# EAGLE design darwin-radio (EAGLE 9.4.2)
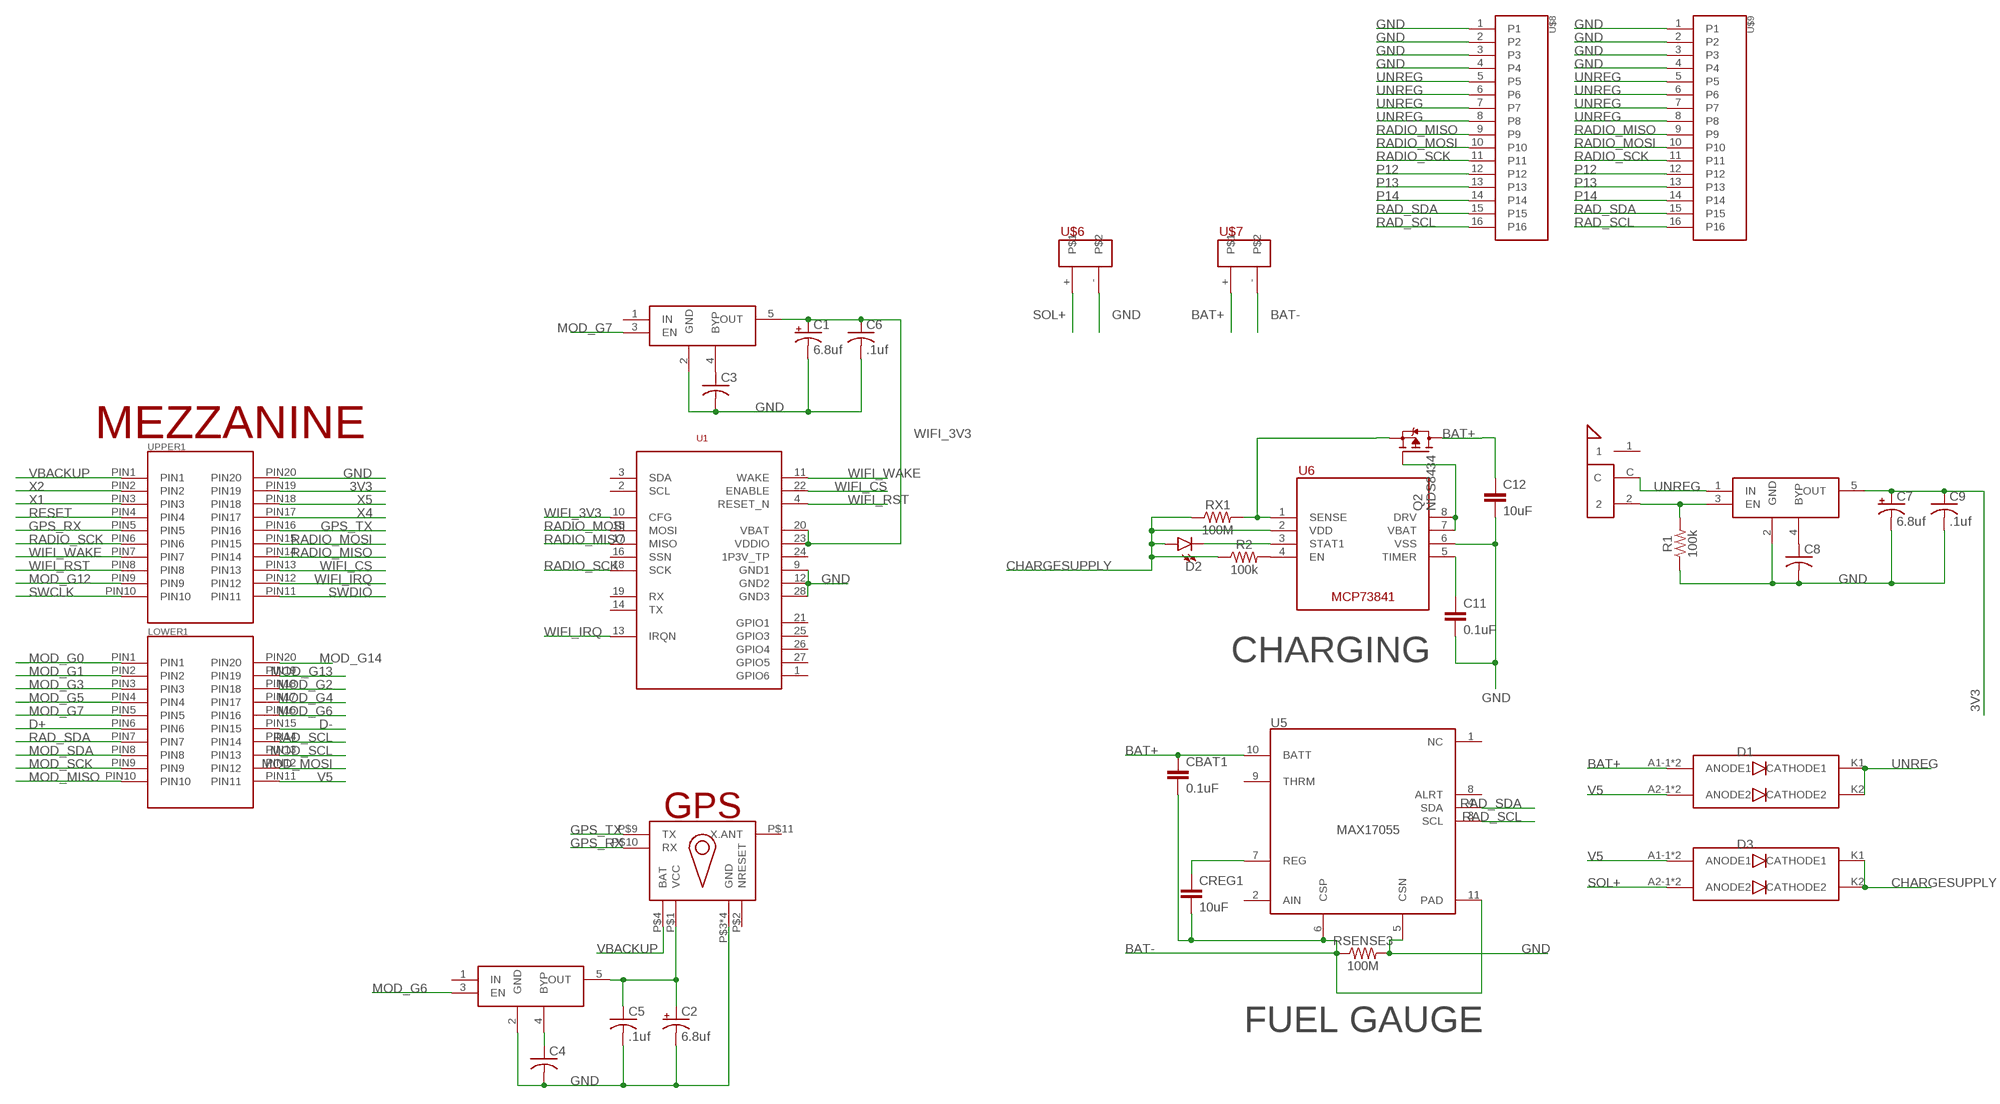
[diagram p0: schematic, sheet 1]

## Parts
C1  6.8uf  CPOL-USA/3216-18R  [A/3216-18R]
C2  6.8uf  CPOL-USA/3216-18R  [A/3216-18R]
C3  C-USC0603K  [C0603K]
C4  C-USC0603K  [C0603K]
C5  .1uf  C-USC0603K  [C0603K]
C6  .1uf  C-USC0603K  [C0603K]
C7  6.8uf  CPOL-USA/3216-18R  [A/3216-18R]
C8  C-USC0603K  [C0603K]
C9  .1uf  C-USC0603K  [C0603K]
C11  0.1uF  0.1UF-0603-25V-(+80/-20%)  [0603]
C12  10uF  10UF-0603-6.3V-20%  [0603]
CBAT1  0.1uF  0.1UF-0603-25V-(+80/-20%)  [0603]
CREG1  10uF  10UF-0603-6.3V-20%  [0603]
D1  V10KL45DUHM3/H  [V10KL45DUHM3/H]
D2  LED0603  [LED-0603]
D3  V10KL45DUHM3/H  [V10KL45DUHM3/H]
LOWER1  MOLEX-15-91-2200  [20PH]
Q2  NDS8434  [SO08-IRF]
R1  100k  100KOHM-0603-1/10W-1%  [0603]
R2  100k  100KOHM-0603-1/10W-1%  [0603]
RSENSE3  100M  1MOHM-0603-1/4W-5%  [0603]
RX1  100M  1MOHM-0603-1/4W-5%  [0603]
U1  ATWINC  [ATWINC]
U5  MAX17055  [SON50P300X300X75-11T150X230]
U6  MCP7384X  [SOP65P490X110-8]
U$1  FGPMMOPA6H  [GPS_MODULE]
U$2  MIC5219-3.3YM5-TR  [SOT95P280X145-5]
U$3  MIC5219-3.3YM5-TR  [SOT95P280X145-5]
U$4  MIC5219-3.3YM5-TR  [SOT95P280X145-5]
U$5  SSAJ110100  [SSAJ110100]
U$6  B2B-PH-SM4-TB  [B2B-PH-SM4-TB]
U$7  B2B-PH-SM4-TB  [B2B-PH-SM4-TB]
U$8  505110-1692  [505110-1692]
U$9  505110-1692  [505110-1692]
UPPER1  MOLEX-15-91-2200  [20PH]

## Nets
3V3: C7.+ C9.1 U$4.5(OUT) UPPER1.PIN19
BAT+: C12.1 CBAT1.1 D1.A1-1(ANODE1) D1.A1-2(ANODE1) Q2.5(D) Q2.6(D) Q2.7(D) Q2.8(D) U5.10(BATT) U$7.+
BAT-: CBAT1.2 CREG1.2 RSENSE3.1 U5.6(CSP) U5.11(PAD) U$7.-
CHARGESUPPLY: D2.A D3.K1(CATHODE1) D3.K2(CATHODE2) R2.1 RX1.1 U6.2(VDD)
D+: LOWER1.PIN6
D-: LOWER1.PIN15
GND: C1.- C2.- C3.2 C4.2 C5.2 C6.2 C7.- C8.2 C9.2 C11.2 C12.2 R1.1 RSENSE3.2 U1.9(GND1) U1.12(GND2) U1.28(GND3) U5.5(CSN) U6.6(VSS) U$1.P$3(GND) U$1.P$8(GND) U$1.P$12(GND) U$1.P$19(GND) U$2.2(GND) U$3.2(GND) U$4.2(GND) U$6.- U$8.1 U$8.2 U$8.3 U$8.4 U$9.1 U$9.2 U$9.3 U$9.4 UPPER1.PIN20
GPS_RX: U$1.P$10(RX) UPPER1.PIN5
GPS_TX: U$1.P$9(TX) UPPER1.PIN16
MOD_G0: LOWER1.PIN1
MOD_G1: LOWER1.PIN2
MOD_G2: LOWER1.PIN18
MOD_G3: LOWER1.PIN3
MOD_G4: LOWER1.PIN17
MOD_G5: LOWER1.PIN4
MOD_G6: LOWER1.PIN16 U$2.3(EN)
MOD_G7: LOWER1.PIN5 U$3.3(EN)
MOD_G12: UPPER1.PIN9
MOD_G13: LOWER1.PIN19
MOD_G14: LOWER1.PIN20
MOD_MISO: LOWER1.PIN10
MOD_MOSI: LOWER1.PIN12
MOD_SCK: LOWER1.PIN9
MOD_SCL: LOWER1.PIN13
MOD_SDA: LOWER1.PIN8
N$1: C3.1 U$3.4(BYP)
N$2: C4.1 U$2.4(BYP)
N$3: C2.+ C5.1 U$1.P$1(VCC) U$2.5(OUT)
N$5: R2.2 U6.4(EN)
N$6: C8.1 U$4.4(BYP)
N$8: R1.2 U$4.3(EN) U$5.2
N$14: Q2.1(S) Q2.2(S) Q2.3(S) RX1.2 U6.1(SENSE)
N$16: D2.C U6.3(STAT1)
N$17: Q2.4(G) U6.7(VBAT) U6.8(DRV)
N$18: C11.1 U6.5(TIMER)
N$19: CREG1.1 U5.7(REG)
P12: U$8.12 U$9.12
P13: U$8.13 U$9.13
P14: U$8.14 U$9.14
RAD_SCL: LOWER1.PIN14 U5.3(SCL) U$8.16 U$9.16
RAD_SDA: LOWER1.PIN7 U5.4(SDA) U$8.15 U$9.15
RADIO_MISO: U1.17(MISO) U$8.9 U$9.9 UPPER1.PIN14
RADIO_MOSI: U1.15(MOSI) U$8.10 U$9.10 UPPER1.PIN15
RADIO_SCK: U1.18(SCK) U$8.11 U$9.11 UPPER1.PIN6
RESET: UPPER1.PIN4
SOL+: D3.A2-1(ANODE2) D3.A2-2(ANODE2) U$6.+
SWCLK: UPPER1.PIN10
SWDIO: UPPER1.PIN11
UNREG: D1.K1(CATHODE1) D1.K2(CATHODE2) U$4.1(IN) U$5.C U$8.5 U$8.6 U$8.7 U$8.8 U$9.5 U$9.6 U$9.7 U$9.8
V5: D1.A2-1(ANODE2) D1.A2-2(ANODE2) D3.A1-1(ANODE1) D3.A1-2(ANODE1) LOWER1.PIN11
VBACKUP: U$1.P$4(BAT) UPPER1.PIN1
WIFI_3V3: C1.+ C6.1 U1.10(CFG) U1.20(VBAT) U1.23(VDDIO) U$3.5(OUT)
WIFI_CS: U1.22(ENABLE) UPPER1.PIN13
WIFI_IRQ: U1.13(IRQN) UPPER1.PIN12
WIFI_RST: U1.4(RESET_N) UPPER1.PIN8
WIFI_WAKE: U1.11(WAKE) UPPER1.PIN7
X1: UPPER1.PIN3
X2: UPPER1.PIN2
X4: UPPER1.PIN17
X5: UPPER1.PIN18
Unconnected: U1.1(GPIO6) U1.2(SCL) U1.3(SDA) U1.14(TX) U1.16(SSN) U1.19(RX) U1.21(GPIO1) U1.24(1P3V_TP) U1.25(GPIO3) U1.26(GPIO4) U1.27(GPIO5) U5.1(NC) U5.2(AIN) U5.8(ALRT) U5.9(THRM) U$1.P$2(NRESET) U$1.P$11(X.ANT) U$2.1(IN) U$3.1(IN) U$5.1

## Notes on the sheet
- MEZZANINE
- CHARGING
- FUEL GAUGE

## Library data of the parts
C1 C2 C7 = rcl:CPOL-US: POLARIZED CAPACITOR, American symbol; SPICEPREFIX: C
C3-C6 C8 C9 = rcl:C-US: CAPACITOR, American symbol; SPICEPREFIX: C
C11 CBAT1 = SparkFun-Capacitors:0.1UF: 0.1µF ceramic capacitors A capacitor is a passive two-terminal electrical component used to store electrical energy temporarily in an electric field.; PROD_ID: CAP-00810
C12 CREG1 = SparkFun-Capacitors:10UF: 10.0µF ceramic capacitors A capacitor is a passive two-terminal electrical component used to store electrical energy temporarily in an electric field.; PROD_ID: CAP-11015
D1 D3 = Conservify:V10KL45DUHM3/H
D2 = SparkFun-LED:LED: LED (Generic) Standard schematic elements and footprints for 5mm, 3mm, 1206, and 0603 sized LEDs. Generic LEDs with no color specified.
LOWER1 UPPER1 = Conservify:MOLEX-15-91-2200
Q2 = Conservify:NDS8434: NDS8434 Single P-Channel Enhancement Mode Field Effect Transistor
R1 R2 = SparkFun-Resistors:100KOHM: 100kΩ resistor A resistor is a passive two-terminal electrical component that implements electrical resistance as a circuit element. Resistors act to reduce current flow, and, at the same time, act to lower voltage levels within circuits. - Wikipedia; PROD_ID: RES-07828
RSENSE3 RX1 = SparkFun-Resistors:1MOHM: 1MΩ resistor A resistor is a passive two-terminal electrical component that implements electrical resistance as a circuit element. Resistors act to reduce current flow, and, at the same time, act to lower voltage levels within circuits. - Wikipedia; PROD_ID: RES-07868; VALUE: 1M
U1 = Conservify:ATWINC
U5 = Conservify:MAX17055
U6 = Conservify:MCP7384X: Advanced Single or Dual Cell Lithium-Ion/ Lithium-Polymer Charge Management Controllers
U$1 = Conservify:FGPMMOPA6H
U$2-U$4 = Conservify:MIC5219-3.3YM5-TR
U$5 = Conservify:SSAJ110100
U$6 U$7 = Conservify:B2B-PH-SM4-TB
U$8 U$9 = Conservify:505110-1692

## Board
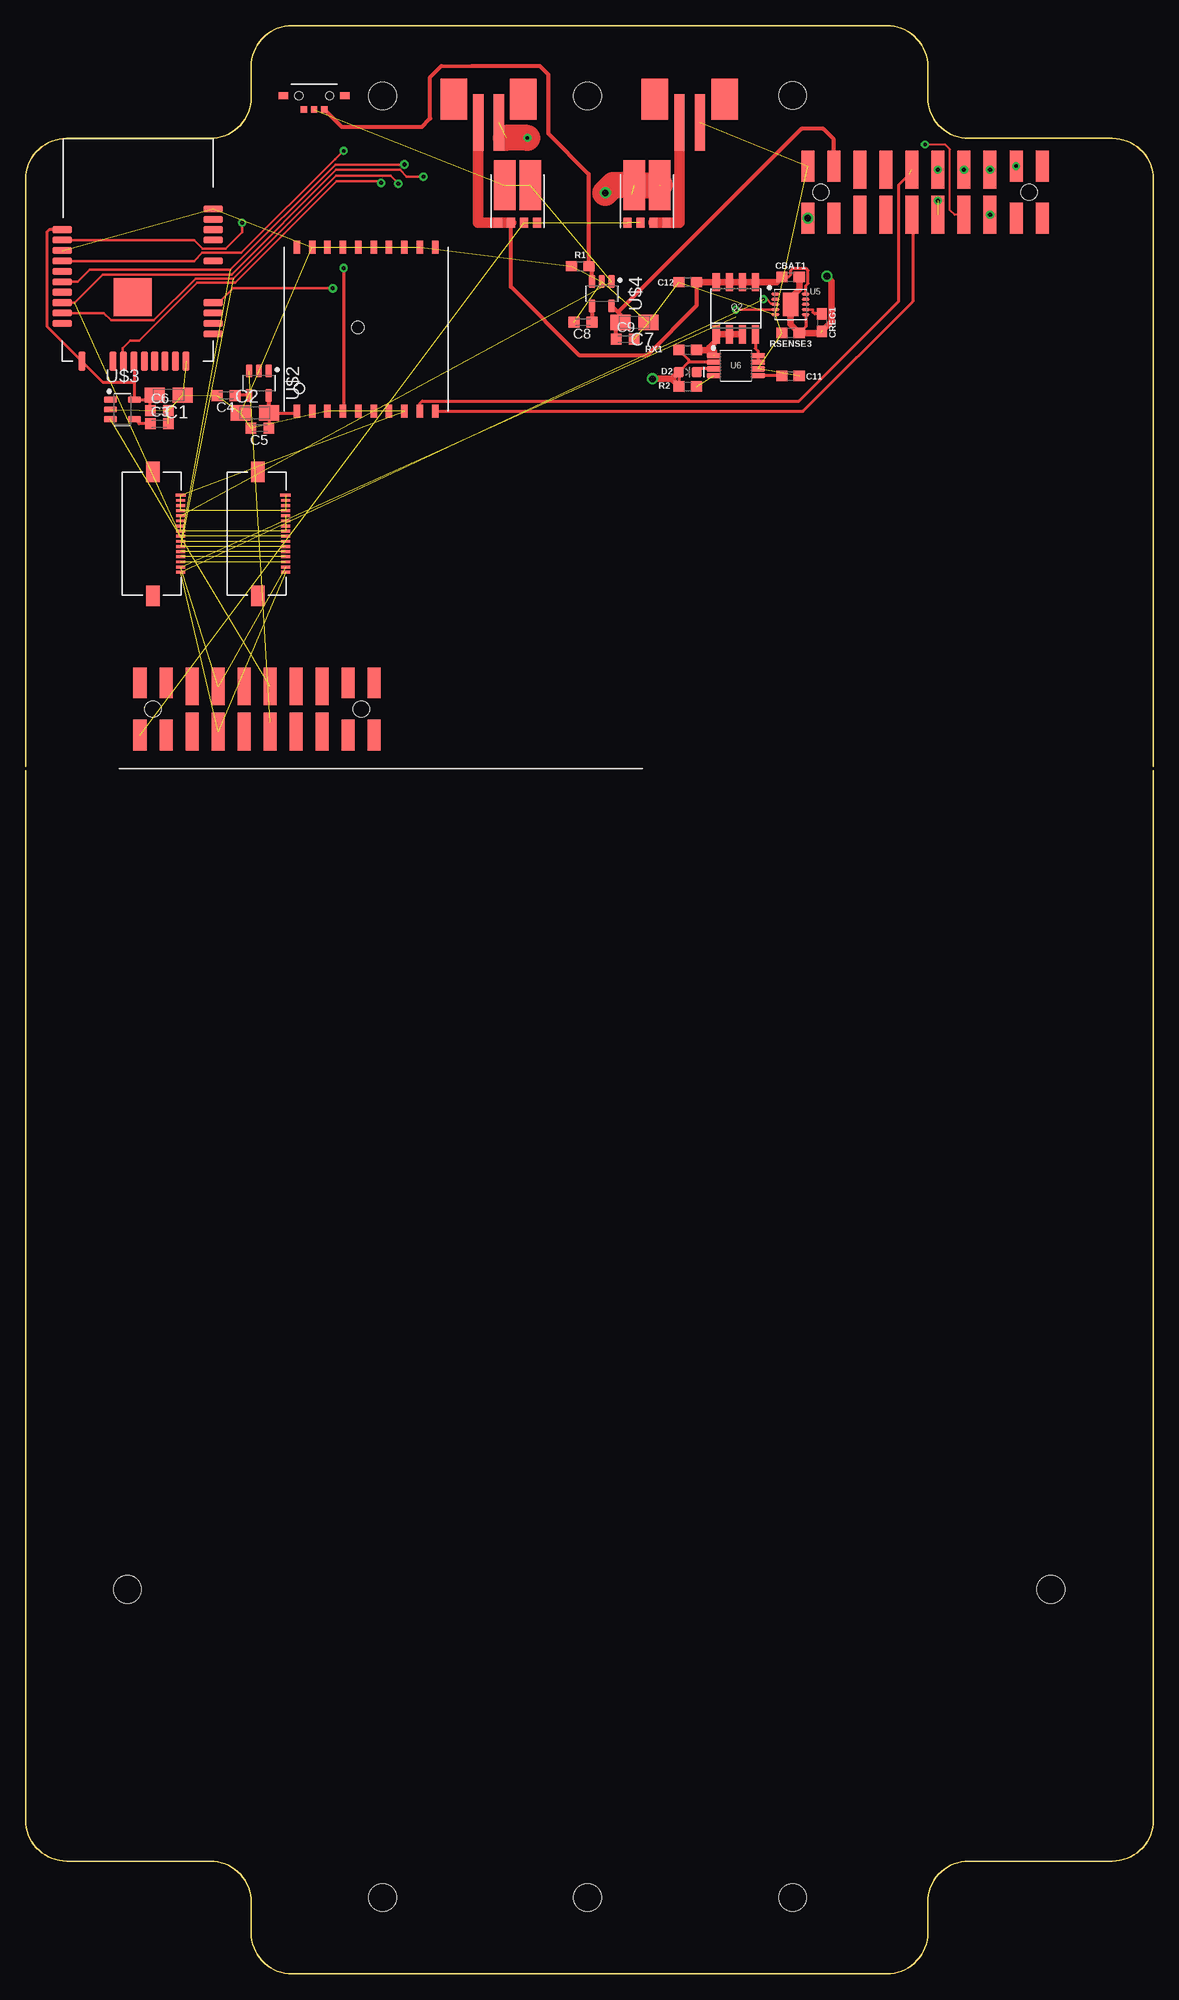
[diagram p1: board, top side]
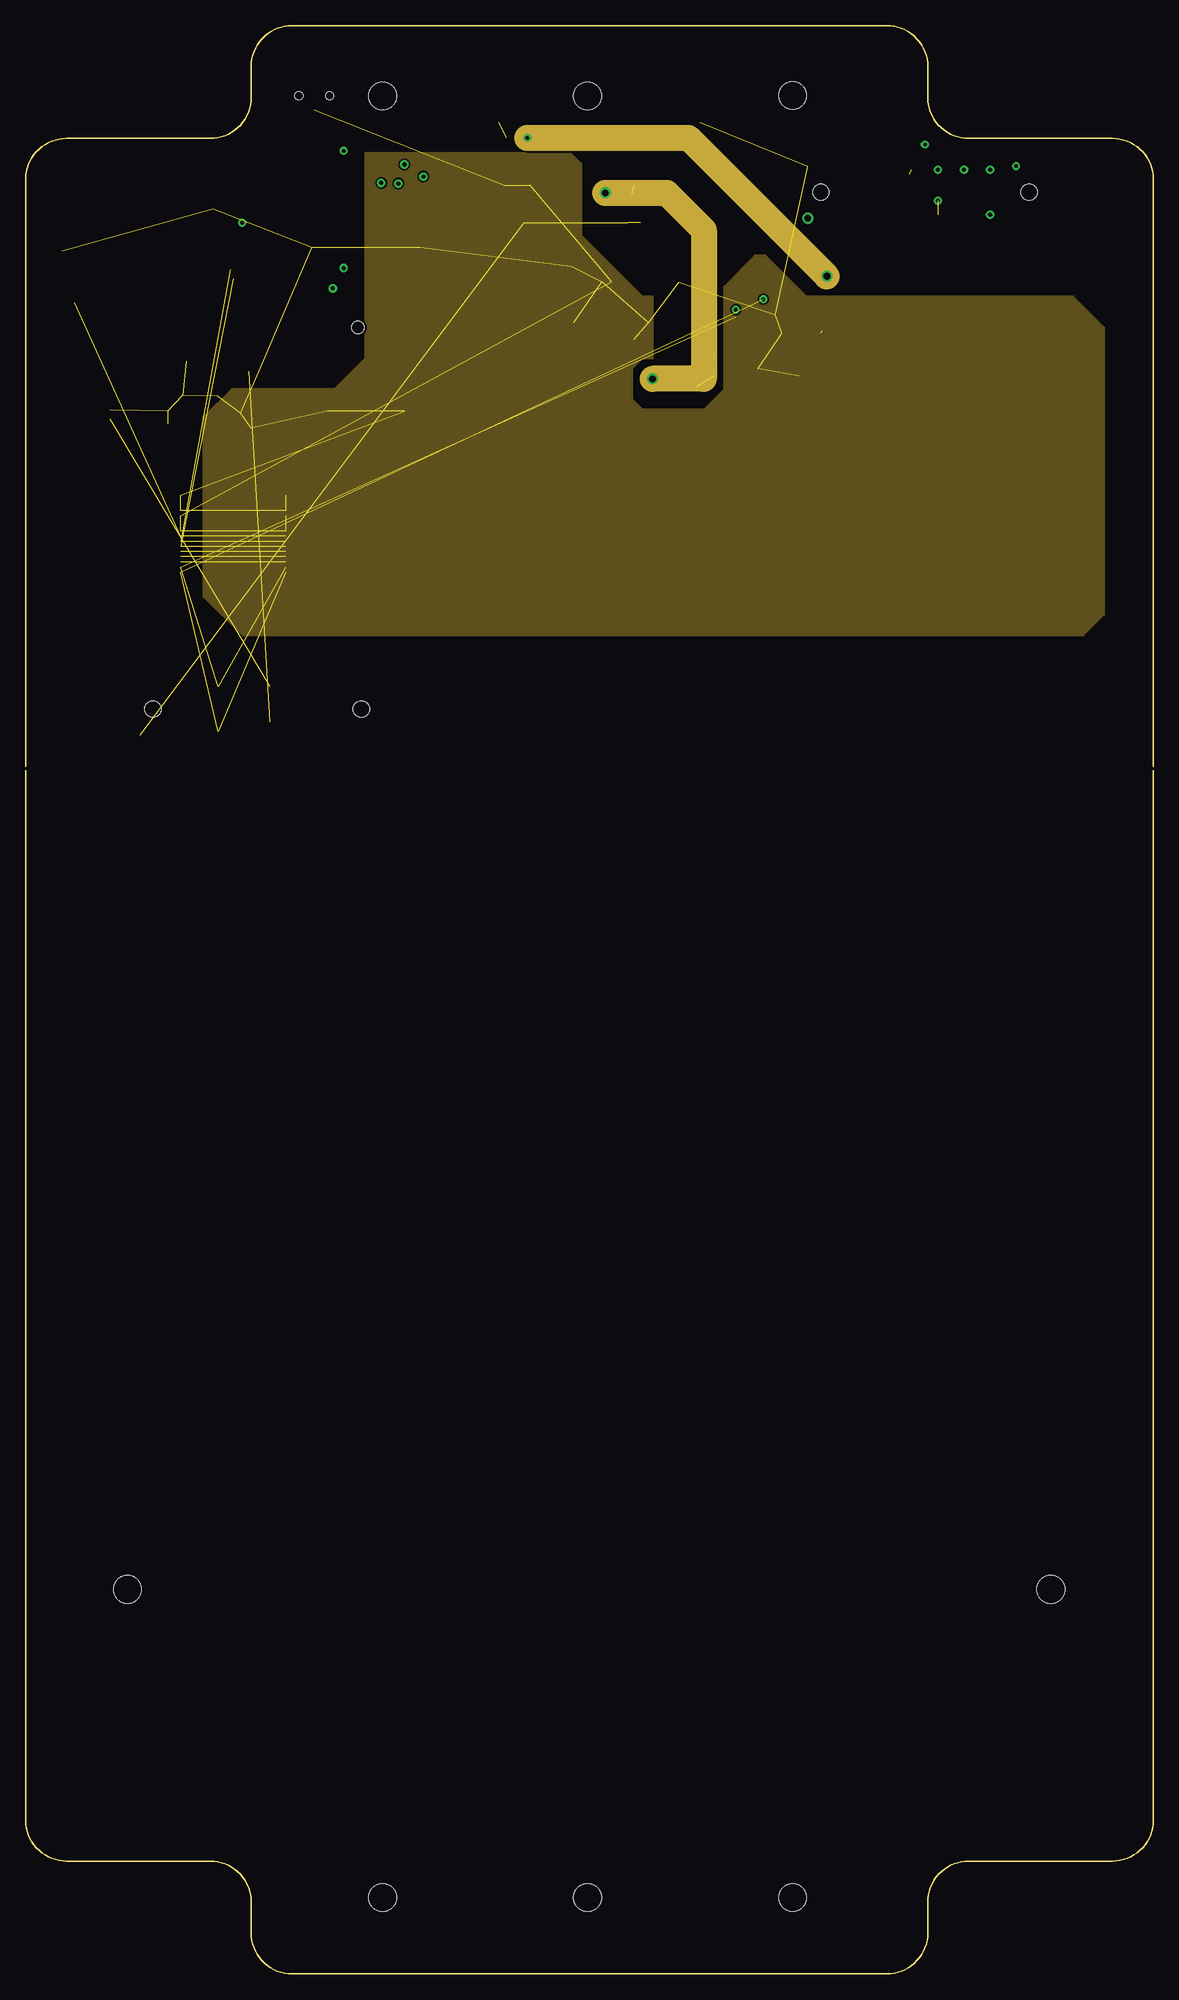
[diagram p2: board, inner layer PWR]
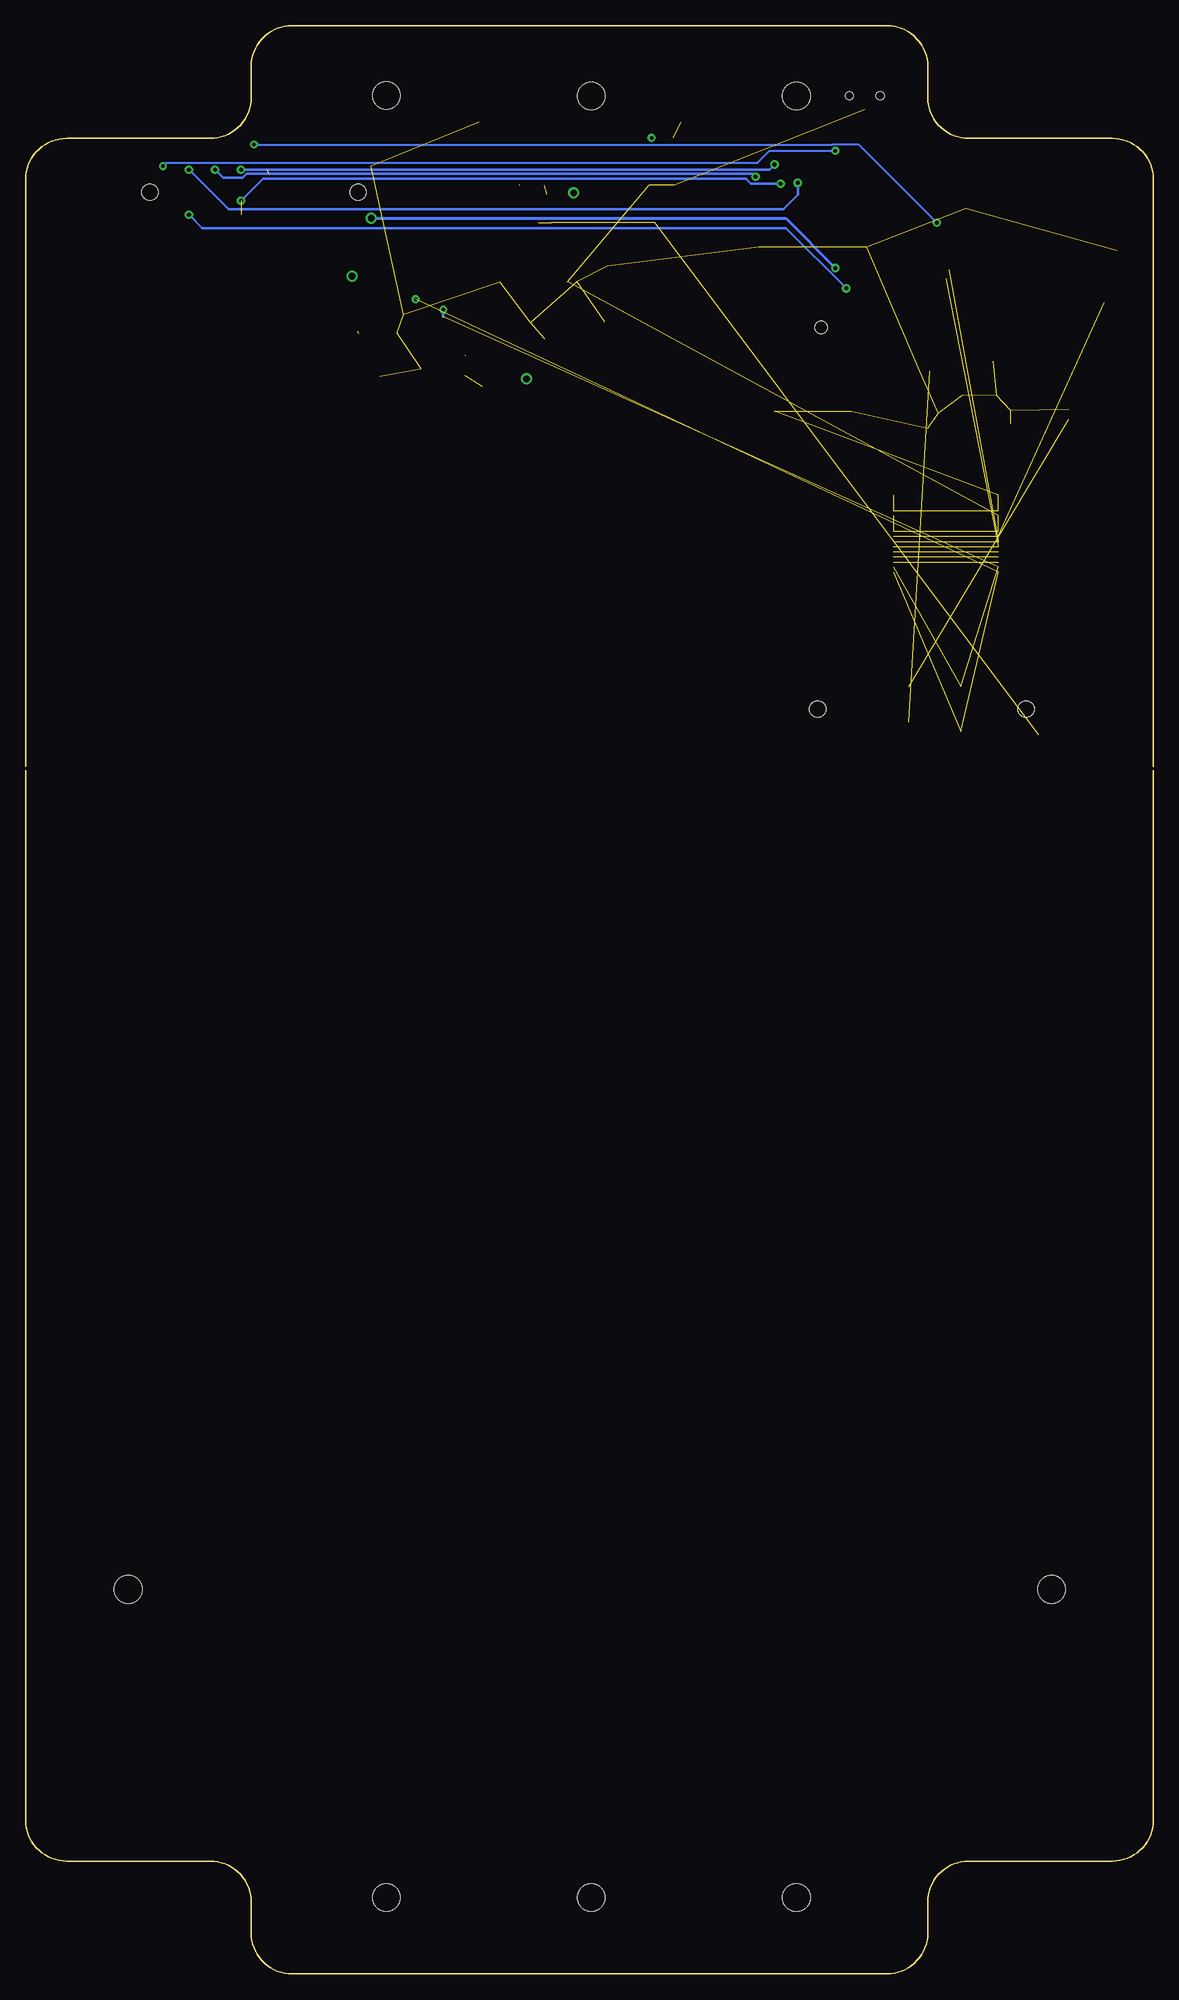
[diagram p3: board, bottom side, seen from below]

Size 110 x 190 mm. Coordinates in mm from the lower left corner, seen from the top.
Outline: 0,117.76 0,175 arc-90 4,179 18,179 arc90 22,183 22,186 arc-90 26,190 84,190 arc-90 88,186 88,183 arc90 92,179 106,179 arc-90 110,175 110,117.76
Outline: 0,117.35 0,15 arc90 4,11 18,11 arc-90 22,7 22,4 arc90 26,0 84,0 arc90 88,4 88,7 arc-90 92,11 106,11 arc90 110,15 110,117.35
Copper layers (1+2*15+16): Top 0.035mm / dielectric 1.5mm / PWR 0.035mm / dielectric 0.15mm / GND 0.035mm / dielectric 0.2mm / Bottom 0.035mm
Design rules "default *": minimum track width 6mil, minimum drill 0.3mm, track to track 6mil, track to pad 6mil, pad to pad 6mil, via to via 6mil, smd to smd 6mil, copper to edge 10mil, drill to drill 6mil, minimum pad ring 10mil, minimum via ring 8mil, stop-mask expansion 4mil, vias tented up to drill 0.31mm, thermal gap 10mil
Holes 2.7 mm at 9.92,37.5 34.82,7.45 54.82,7.45 74.82,7.45 100,37.5 34.82,183.13 54.82,183.13 74.82,183.18

### Footprints (pad centres in the part's own frame; a part is rotated, then mirrored left to right if it is on the bottom)
A/3216-18R = smd 1.95 x 1.5: + 1.375,0; - -1.375,0
C0603K = smd 1.05 x 1.08: 1 -0.875,0; 2 0.875,0
0603 = smd 1.1 x 1: 1 -0.85,0; 2 0.85,0
V10KL45DUHM3/H = smd 0.762 x 0.991: A1-1 -1.905,0.495; A1-2 -0.635,0.495; A2-1 0.635,0.495; A2-2 1.905,0.495 | smd 2.083 x 4.851: K1 -1.245,4.153; K2 1.245,4.153
LED-0603 = smd 1 x 1: A -0.877,0; C 0.877,0
20PH = smd 3 x 1.27: PIN1 -0.34,0; PIN2 -0.34,-2.54; PIN9 -0.34,-20.32; PIN10 -0.34,-22.86; PIN11 4.74,-22.86; PIN12 4.74,-20.32; PIN19 4.74,-2.54; PIN20 4.74,0 | smd 3.68 x 1.27: PIN3 0,-5.08; PIN4 0,-7.62; PIN5 0,-10.16; PIN6 0,-12.7; PIN7 0,-15.24; PIN8 0,-17.78; PIN13 4.4,-17.78; PIN14 4.4,-15.24; PIN15 4.4,-12.7; PIN16 4.4,-10.16; PIN17 4.4,-7.62; PIN18 4.4,-5.08 | hole 1.58: 2.2,-1.27; 2.2,-21.59
SO08-IRF = smd 0.72 x 1.78: 1 -1.905,-2.543; 2 -0.635,-2.543; 3 0.635,-2.543; 4 1.905,-2.543; 5 1.905,2.543; 6 0.635,2.543; 7 -0.635,2.543; 8 -1.905,2.543
ATWINC = smd 1.9 x 0.7: 1 7.365,2.67; 2 7.365,3.686; 3 7.365,4.702; 4 7.365,5.718; 5 7.365,9.782; 6 7.365,11.814; 7 7.365,12.83; 8 7.365,13.846; 9 7.365,14.862; 10 -7.365,12.83; 11 -7.365,11.814; 12 -7.365,10.798; 13 -7.365,9.782; 14 -7.365,8.766; 15 -7.365,7.75; 16 -7.365,6.734; 17 -7.365,5.718; 18 -7.365,4.702; 19 -7.365,3.686 | smd 0.7 x 1.9: 20 -5.465,0; 21 -2.417,0; 22 -1.401,0; 23 -0.385,0; 24 0.631,0; 25 1.647,0; 26 2.663,0; 27 3.679,0; 28 4.695,0 | smd 3.7 x 3.7: PAD -0.485,6.27
SON50P300X300X75-11T150X230 = smd 0.779 x 0.282: 1 -1.475,1; 2 -1.475,0.5; 3 -1.475,0; 4 -1.475,-0.5; 5 -1.475,-1; 6 1.475,-1; 7 1.475,-0.5; 8 1.475,0; 9 1.475,0.5; 10 1.475,1 | smd 1.5 x 2.3: 11 0,0
SOP65P490X110-8 = smd 1.412 x 0.492: 1 -2.15,0.975; 2 -2.15,0.325; 3 -2.15,-0.325; 4 -2.15,-0.975; 5 2.15,-0.975; 6 2.15,-0.325; 7 2.15,0.325; 8 2.15,0.975
GPS_MODULE = smd 1.27 x 0.635: P$1 -8,6.75; P$2 -8,5.25; P$3 -8,3.75; P$4 -8,2.25; P$5 -8,0.75; P$6 -8,-0.75; P$7 -8,-2.25; P$8 -8,-3.75; P$9 -8,-5.25; P$10 -8,-6.75; P$11 8,-6.75; P$12 8,-5.25; P$13 8,-3.75; P$14 8,-2.25; P$15 8,-0.75; P$16 8,0.75; P$17 8,2.25; P$18 8,3.75; P$19 8,5.25; P$20 8,6.75 | hole 1.2: 0.2,0.8
SOT95P280X145-5 = smd 1.262 x 0.609: 1 -1.175,0.95; 2 -1.175,0; 3 -1.175,-0.95; 4 1.175,-0.95; 5 1.175,0.95
SSAJ110100 = smd 0.6 x 0.6: 1 1,1.355; 2 -1,1.355; C 0,1.355 | smd 0.9 x 0.7: PAD -3,0; PAD2 3,0 | hole 0.8: -1.5,0; 1.5,0
B2B-PH-SM4-TB = smd 1 x 5.5: + -1,-1; - 1,-1 | smd 2.6 x 4: PAD1 3.4,1.25; PAD2 -3.4,1.25
505110-1692 = smd 0.3 x 1: 1 -3.75,2.7; 2 -3.25,2.7; 3 -2.75,2.7; 4 -2.25,2.7; 5 -1.75,2.7; 6 -1.25,2.7; 7 -0.75,2.7; 8 -0.25,2.7; 9 0.25,2.7; 10 0.75,2.7; 11 1.25,2.7; 12 1.75,2.7; 13 2.25,2.7; 14 2.75,2.7; 15 3.25,2.7; 16 3.75,2.7 | smd 2 x 1.3: PAD1 -6.05,0; PAD2 6.05,0

### Placement (x,y rotation side)
C1  13.94,153.97 180 top
C2  22.36,152.23 0 top
C3  13.04,151.17 0 top
C4  19.56,153.93 180 top
C5  22.86,150.73 180 top
C6  13.04,152.47 0 top
C7  59.38,161.06 180 top
C8  54.36,161.09 180 top
C9  58.48,159.42 0 top
C11  74.61,155.83 0 top
C12  64.58,164.98 180 top
CBAT1  74.61,165.48 0 top
CREG1  77.66,161.04 270 top
D1  47.97,170.29 0 top
D2  64.58,156.21 0 top
D3  60.61,170.29 0 top
LOWER1  34.01,125.56 270 top
Q2  69.28,162.44 0 top
R1  54.11,166.54 0 top
R2  64.58,154.82 0 top
RSENSE3  74.61,160.02 180 top
RX1  64.58,158.37 0 top
U1  10.94,157.27 0 top
U5  74.61,162.82 0 top
U6  69.28,156.85 0 top
U$1  33.2,160.38 90 top
U$2  22.76,155.13 270 top
U$3  9.44,152.57 0 top
U$4  56.2,163.86 270 top
U$5  28.14,183.18 180 top
U$6  64.78,181.56 0 top
U$7  45.15,181.56 0 top
U$8  12.43,140.45 270 top
U$9  22.64,140.45 270 top
UPPER1  76.29,171.56 90 top

### Tracks (layer width: path | path; a pad name or v marks a point on that pad's centre or on a via)
3V3
  Top 0.406: U$4.5 57.79,162.04 | 57.79,162.04 58.01,161.83 C7.+ 57.61,160.65 C9.1 | UPPER1.PIN19 78.83,178.91 77.81,179.92 75.68,179.92 57.79,162.04
BAT+
  Top 0.305: CBAT1.1 74.42,165.48 74.61,165.67 74.61,166.11 74.79,166.29 76.14,166.29 76.32,166.11 76.32,164.86 76.09,164.63 U5.10
  Top 0.406: C12.1 65.43,162.67 60.59,157.83 54.04,157.83 47.33,164.53 47.33,170.78 D1.A1-2
  Top 0.61: CBAT1.1 73.26,164.98 Q2.5 Q2.6 Q2.7 Q2.8 C12.1 65.59,164.82
  Top 1.016: 46.04,170.76 D1.A1-1 | D1.A1-2 47.31,170.76 46.04,170.76 | 46.04,170.76 44.15,170.76 U$7.+
BAT-  (via drill 0.35, 0.65)  (2 unrouted)
  Top 0.305: U5.6 76.09,160.65 RSENSE3.1
  Top 0.61: CBAT1.2 75.46,164.3 74.36,163.2 74.36,163.07 U5.11 74.61,160.87 RSENSE3.1 77.53,160.02 | CREG1.2 78.62,161.15 78.62,162.56 78.62,162.63 78.62,165.09 v78.15,165.56
  Top 2.54: v48.95,179.06 46.85,179.06
  PWR 2.54: v78.15,165.56 64.65,179.06 v48.95,179.06
CHARGESUPPLY  (via drill 0.65)  (2 unrouted)
  Top 0.305: U6.2 64.66,157.17 | 64.66,157.17 D2.A 63.73,156.19 R2.1 | RX1.1 64.66,157.44 64.66,157.17
  Top 0.61: D2.A 63.05,155.56 v61.15,155.56 62.99,155.56 R2.1
  Top 1.016: 59.15,173.56 59.15,175.56
  Top 2.54: v56.55,173.7 57.29,174.44 D3.K1 61.85,174.44
  PWR 2.54: v56.55,173.7 62.51,173.7 66.15,170.06 66.15,155.56 v61.15,155.56
GND  (34 unrouted)
GPS_RX
  Top 0.305: UPPER1.PIN5 86.53,171.48 86.53,163.09 75.82,152.38 U$1.P$10
GPS_TX  (1 unrouted)
  Top 0.305: 86.19,175.5 85.16,174.47 85.16,163.13 75.43,153.4 38.67,153.4 38.45,153.18 U$1.P$9
MOD_G0
  Top 0.152: LOWER1.PIN1 34.07,125.96
MOD_G6  (1 unrouted)
  Top 0.406: LOWER1.PIN16 23.85,122.08
MOD_G7  (1 unrouted)
N$1
  Top 0.305: C3.1 11.07,151.17 U$3.4
N$2
  Top 0.305: U$2.4 20.46,153.96 C4.1
N$3
  Top 0.305: U$1.P$1 26.3,152.23 C2.+ C5.1
  Top 0.406: U$2.5 23.71,152.26 C2.+
N$5  (1 unrouted)
N$6
  Top 0.406: U$4.4 55.25,161.11 C8.1
N$8
  Top 0.406: U$4.3 55.25,166.24 R1.2 54.92,166.57 54.92,175.53 50.97,179.49 50.97,185.26 50.15,186.08 43.5,186.08 40.52,186.06 39.45,184.99 39.45,180.96 38.6,180.11 30.86,180.11 U$5.2
N$14  (1 unrouted)
  Top 0.61: RX1.2 66.49,158.37 66.74,158.63 | 66.74,158.63 67.13,158.24 67.13,157.88 66.98,157.88 66.74,158.12 | 66.74,158.63 67.38,159.26 Q2.1 Q2.2 Q2.3
N$16
  Top 0.305: U6.3 65.77,156.52 D2.C
N$17
  Top 0.305: Q2.4 71.19,158.5 71.43,158.25 U6.8 U6.7
N$18
  Top 0.305: C11.1 73.34,155.87 U6.5
N$19
  Top 0.25: 76.77,162.05 76.77,162.31 U5.7
  Top 0.305: CREG1.1 76.94,161.89 76.77,162.05
P12  (1 unrouted)
P13  (1 unrouted)
P14  (1 unrouted)
RAD_SCL  (via drill 0.35)  (3 unrouted)
  Top 0.254: U5.3 73.06,162.9 72.72,162.9 72.29,163.32 v71.96,163.32
RAD_SDA  (via drill 0.35)  (3 unrouted)
  Top 0.254: U5.4 69.28,162.32 v69.27,162.3
  Bottom 0.254: v69.27,162.3 69.27,161.63
RADIO_MISO  (via drill 0.4)  (2 unrouted)
  Top 0.254: U1.17 4.8,162.99 7.54,165.73 20.08,165.73 30.29,175.94 36.5,175.94 37.17,175.27 v38.8,175.27
  Bottom 0.254: v38.8,175.27 39.07,175.55 88.43,175.55 88.82,175.16 90.73,175.16 UPPER1.PIN14
  other vias: 91.53,175.96
RADIO_MOSI  (via drill 0.4)  (2 unrouted)
  Top 0.254: U1.15 5.1,165.02 6.26,166.18 19.95,166.18 30.23,176.45 v36.95,176.45 v36.95,176.46
  Bottom 0.254: UPPER1.PIN15 37.45,175.96 v36.95,176.46
  other vias: 88.99,175.96 88.99,175.96
RADIO_SCK  (via drill 0.4)  (3 unrouted)
  Top 0.254: U1.18 7.63,161.97 8.34,161.26 12.51,161.26 16.57,165.32 20.24,165.32 30.27,175.35 35.6,175.35 v36.36,174.59
  Bottom 0.254: v88.99,172.93 86.84,175.08 39.74,175.08 39.25,174.59 v36.36,174.59
SOL+
  Top 1.016: U$6.+ 63.78,170.78 63.75,170.76 62.54,170.76 D3.A2-2 D3.A2-1
UNREG  (11 unrouted)
  pour PWR: 30.15,154.56 33.15,157.56 33.15,177.56 53.15,177.56 54.15,176.56 54.15,169.56 60.15,163.56 61.15,163.56 61.15,157.56 60.15,157.56 59.15,156.56 59.15,153.56 60.15,152.56 66.15,152.56 68.15,154.56 68.15,164.56 71.15,167.56 72.15,167.56 76.15,163.56 102.15,163.56 105.15,160.56 105.15,132.56 103.15,130.56 21.15,130.56 17.39,134.32 17.39,151.8 20.15,154.56
V5  (4 unrouted)
VBACKUP  (via drill 0.4, 0.65)
  Top 0.305: v31.02,166.36 31.02,152.46 U$1.P$4
  Bottom 0.305: UPPER1.PIN1 76.27,171.2 35.86,171.2 v31.02,166.36
  other vias: 76.29,171.22
WIFI_3V3
  Top 0.305: 10.62,155.24 U$3.5 12.12,153.52 12.17,153.57 | 10.62,155.24 10.62,157.21 U1.23 | C6.1 12.17,153.57 | 12.17,153.57 C1.+ | 10.62,155.24 7.51,155.24 U1.20 2.07,160.68 2.07,169.87 2.3,170.1 U1.10
WIFI_CS  (via drill 0.4)
  Top 0.254: U1.22 9.47,157.34 9.47,158.54 10.2,159.26 11.09,159.26 16.74,164.92 20.41,164.92 30.33,174.83 34.51,174.83 v34.68,174.66
  Bottom 0.254: UPPER1.PIN13 90.22,172.1 36.1,172.1 34.68,173.52 v34.68,174.66
  other vias: 94.07,175.96
WIFI_IRQ  (via drill 0.35)
  Top 0.203: v31.02,177.79 30.2,176.97 30.17,176.97
  Top 0.254: U1.13 16.42,167.05 17.21,167.85 21.04,167.85 30.17,176.97
  Bottom 0.203: UPPER1.PIN12 96.29,176.61 38.6,176.61 37.43,177.79 v31.02,177.79
  other vias: 96.61,176.3
WIFI_RST  (via drill 0.4)
  Top 0.254: U1.4 18.83,162.99 | 18.83,162.99 19.06,162.99 | v29.96,164.38 20.23,164.38 18.83,162.99
  Bottom 0.254: UPPER1.PIN8 92.76,170.25 35.82,170.25 v29.96,164.38
  other vias: 94.07,171.56
WIFI_WAKE  (via drill 0.35, 0.4)
  Top 0.203: UPPER1.PIN7 90.63,171.56 90.61,171.54 90.16,172 90.16,177.94 89.7,178.4 v87.72,178.4
  Top 0.254: U1.11 16.42,169.08 17.24,168.25 19.5,168.25 21.12,169.87 v21.12,170.78
  Bottom 0.203: v87.72,178.4 31.31,178.4 31.29,178.42 28.76,178.42 v21.12,170.78